# EAGLE schematic IR_CHR_LINSW_J002947Arevs (EAGLE 6.4), part 1 of 2

## Sheet 1 of 5
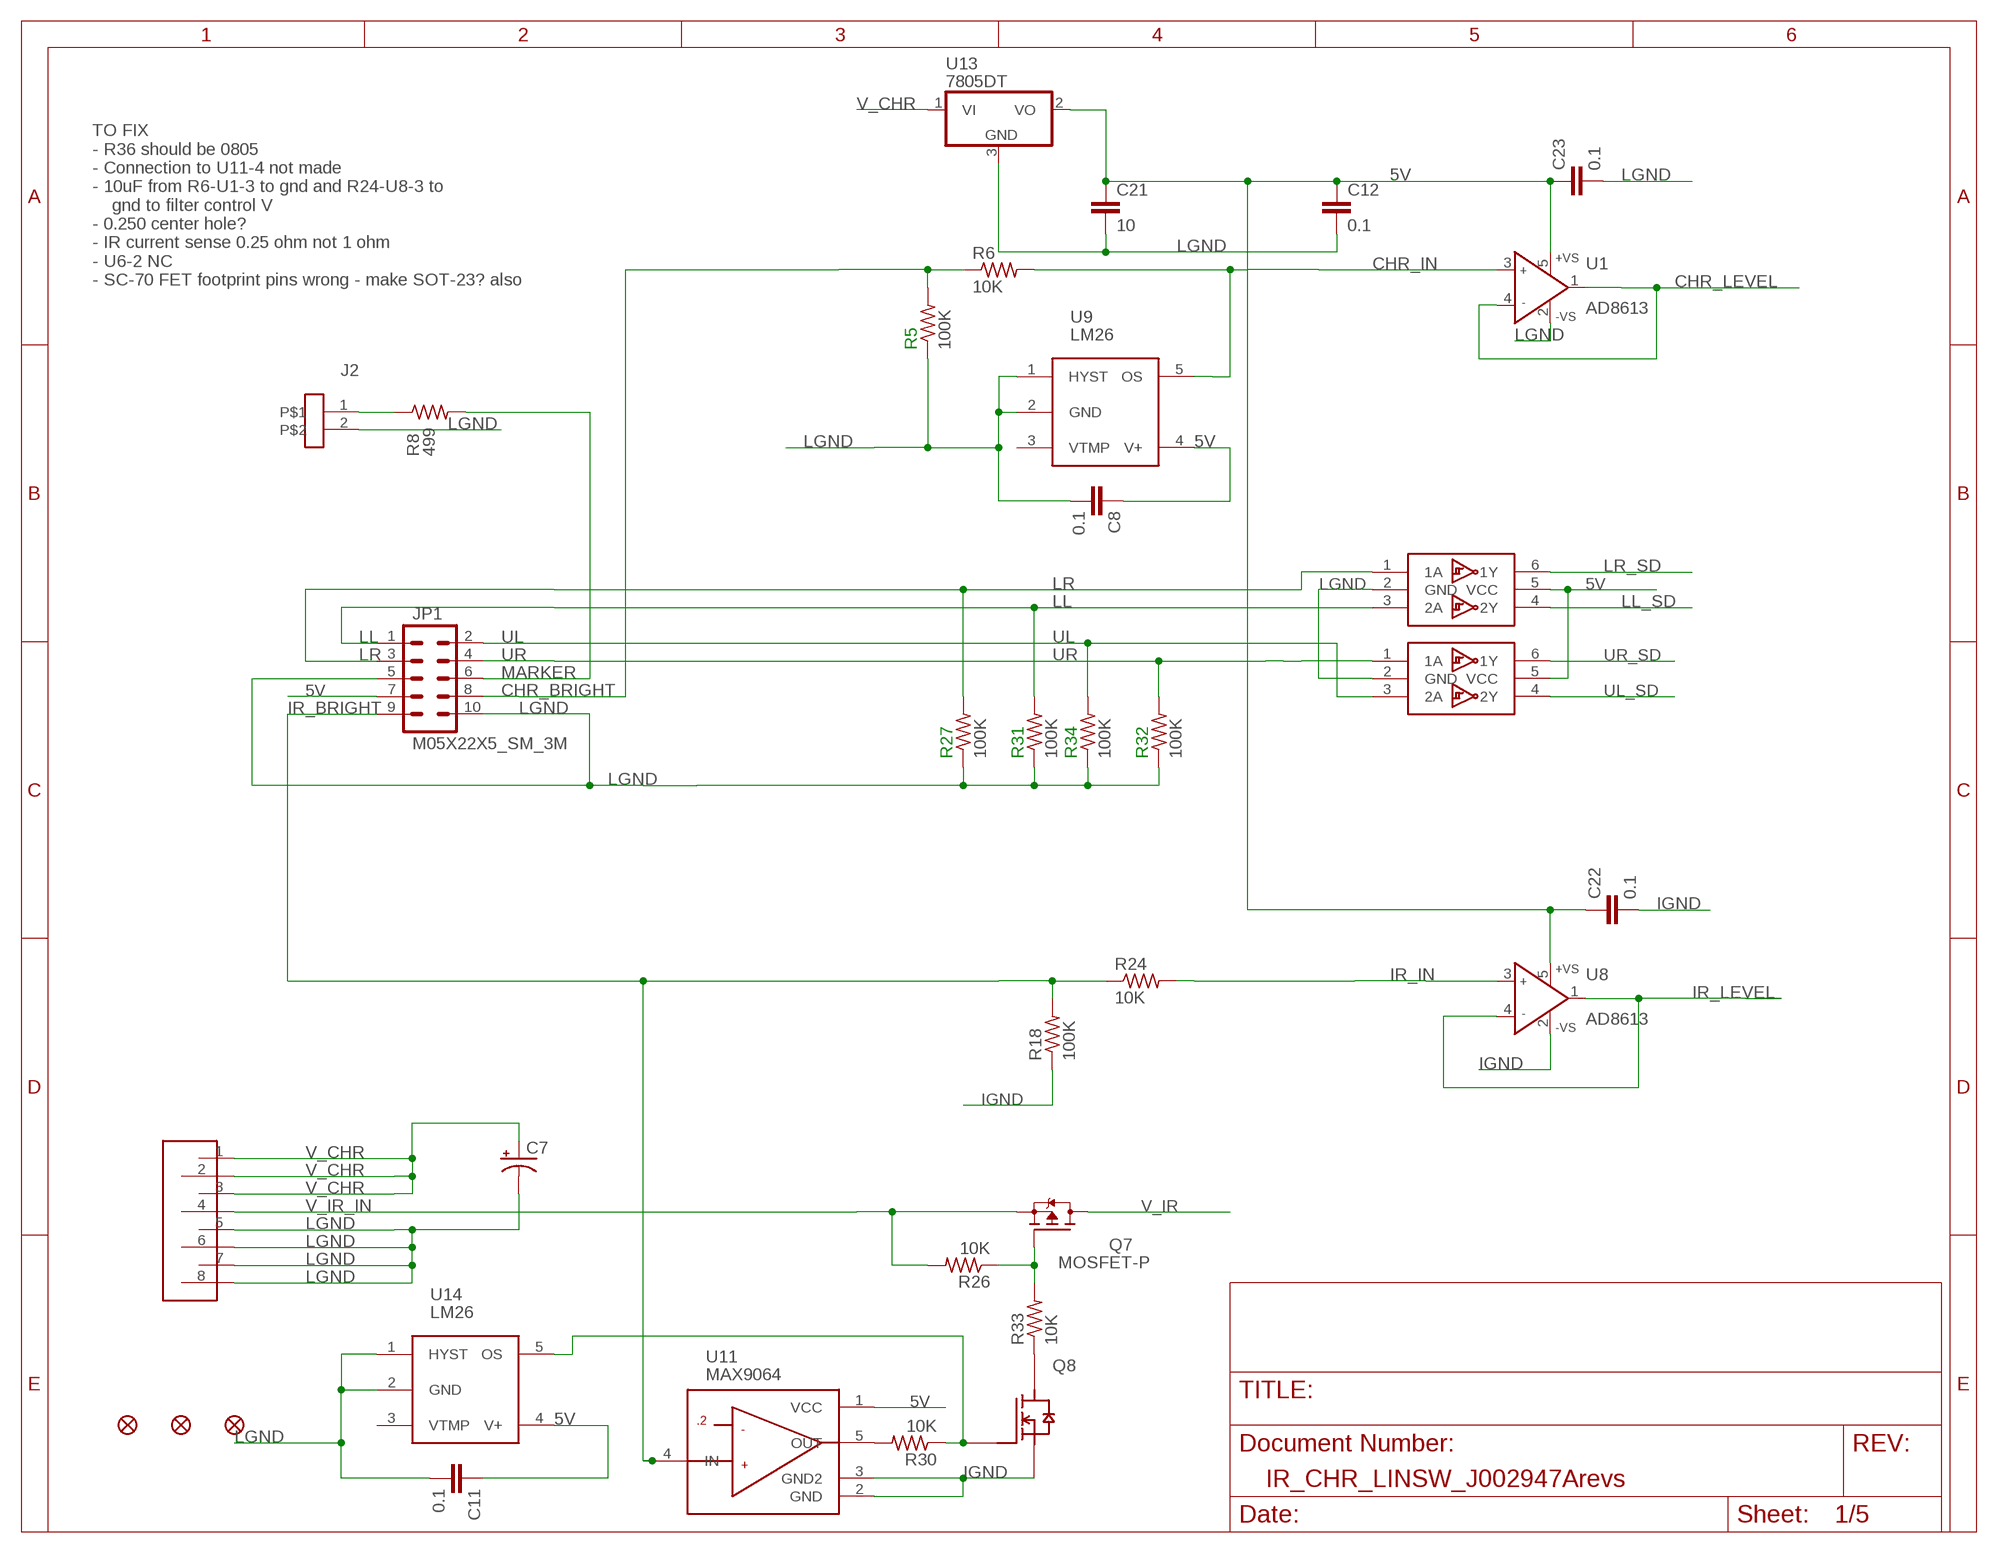
[diagram p0: schematic, sheet 1]

### Parts
C7  CAP_POLG  [PANASONIC_G]
C8  0.1  CAPS0603S  [0603S]
C11  0.1  CAPS0603S  [0603S]
C12  0.1  CAPS0603S  [0603S]
C21  10  CAPS0805S  [0805S]
C22  0.1  CAPS0603S  [0603S]
C23  0.1  CAPS0603S  [0603S]
FID1  FIDUCIAL1.5X3  [FIDUCIAL-1.5X3]
FID2  FIDUCIAL1.5X3  [FIDUCIAL-1.5X3]
FID3  FIDUCIAL1.5X3  [FIDUCIAL-1.5X3]
J1  CON8PHOENIX1778829  [PHOENIX1778829]
J2  CON2DF3-2\  [DF3-2_RA]
JP1  M05X22X5_SM_3M  [2X5-SHROUDED_SMD_3M]
Q7  MOSFET-P  [SO-8POWERPAK]
Q8  MOSFET-N  [SC-70]
R5  100K  RESISTOR_SM0603S  [0603S]
R6  10K  RESISTOR_SM0603S  [0603S]
R8  499  RESISTOR_SM0603S  [0603S]
R18  100K  RESISTOR_SM0603S  [0603S]
R24  10K  RESISTOR_SM0603S  [0603S]
R26  10K  RESISTOR_SM0603S  [0603S]
R27  100K  RESISTOR_SM0603S  [0603S]
R30  10K  RESISTOR_SM0603S  [0603S]
R31  100K  RESISTOR_SM0603S  [0603S]
R32  100K  RESISTOR_SM0603S  [0603S]
R33  10K  RESISTOR_SM0603S  [0603S]
R34  100K  RESISTOR_SM0603S  [0603S]
U1  AD8613  AD8065RT  [SOT23-5]
U8  AD8613  AD8065RT  [SOT23-5]
U9  LM26  [SOT23-5]
U10  74DUAL14  [SOT23-6]
U11  MAX9064  [SOT23-5L]
U12  74DUAL14  [SOT23-6]
U13  7805DT  [TO252]
U14  LM26  [SOT23-5]

### Nets
5V: C8.1 C11.1 C12.1 C21.1 C22.1 C23.1 JP1.7 U1.5(+VS) U8.5(+VS) U9.4(V+) U10.5(VCC) U11.1(VCC) U12.5(VCC) U13.2(VO) U14.4(V+)
CHR_BRIGHT: JP1.8 R5.2 R6.1
CHR_IN: R6.2 U1.3(IN+) U9.5(OS)
CHR_LEVEL: U1.1(OUT) U1.4(IN-) ; also sheet 2,3,4,5
IGND: C22.2 Q8.2(S) R18.1 U8.2(-VS) U11.2(GND) U11.3(GND2) ; also sheet 2,3,4,5
IR_BRIGHT: JP1.9 R18.2 R24.1 U11.4(IN)
IR_IN: R24.2 U8.3(IN+)
IR_LEVEL: U8.1(OUT) U8.4(IN-) ; also sheet 2,3,4,5
LGND: C7.- C8.2 C11.2 C12.2 C21.2 C23.2 J1.5 J1.6 J1.7 J1.8 J2.2 JP1.5 JP1.10 R5.1 R27.1 R31.1 R32.1 R34.1 U1.2(-VS) U9.1(HYST) U9.2(GND) U10.2(GND) U12.2(GND) U13.3(GND) U14.1(HYST) U14.2(GND) ; also sheet 2,3,4,5
LL: JP1.1 R31.2 U10.3(2A)
LL_SD: U10.4(2Y) ; also sheet 3
LR: JP1.3 R27.2 U10.1(1A)
LR_SD: U10.6(1Y) ; also sheet 5
MARKER: JP1.6 R8.2
N$76: J2.1 R8.1
N$171: Q7.4(G) R26.1 R33.2
N$172: Q8.1(G) R30.1 U14.5(OS)
N$173: Q8.3(D) R33.1
N$175: R30.2 U11.5(OUT)
UL: JP1.2 R34.2 U12.3(2A)
UL_SD: U12.4(2Y) ; also sheet 2
UR: JP1.4 R32.2 U12.1(1A)
UR_SD: U12.6(1Y) ; also sheet 4
V_CHR: C7.+ J1.1 J1.2 J1.3 U13.1(VI) ; also sheet 2,3,4,5
V_IR: Q7.5(D) Q7.6(D) Q7.7(D) Q7.8(D) Q7.9(D) ; also sheet 2,3,4,5
V_IR_IN: J1.4 Q7.1(S) Q7.2(S) Q7.3(S) R26.2
Unconnected: U9.3(VTMP) U14.3(VTMP)

### Notes on the sheet
- TO FIX
  - R36 should be 0805
  - Connection to U11-4 not made
  - 10uF from R6-U1-3 to gnd and R24-U8-3 to
      gnd to filter control V
  - 0.250 center hole?
  - IR current sense 0.25 ohm not 1 ohm
  - U6-2 NC
  - SC-70 FET footprint pins wrong - make SOT-23? also

## Sheet 2 of 5
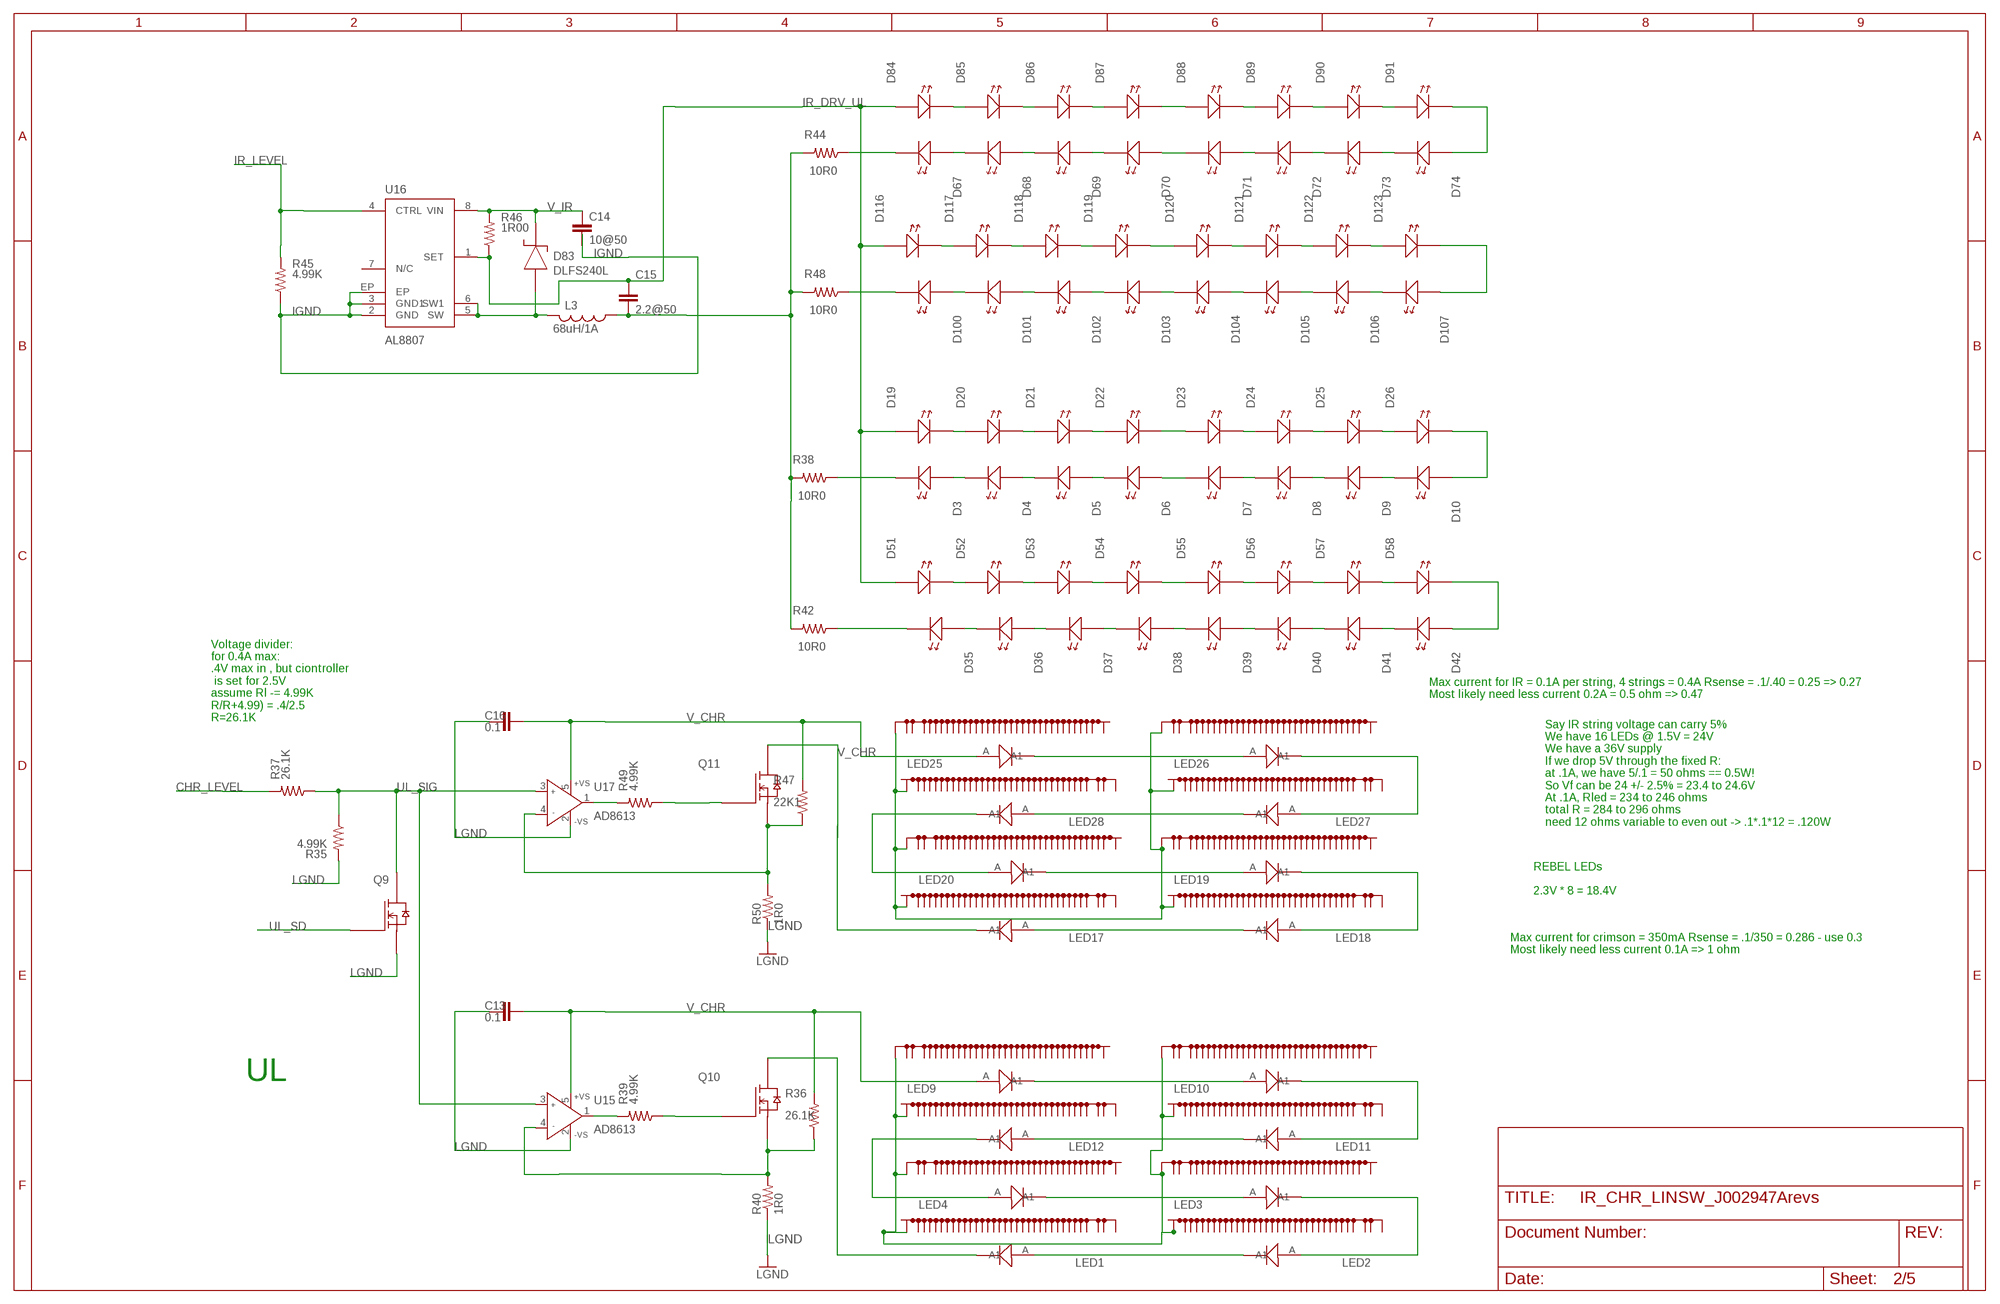
[diagram p1: schematic, sheet 2]

### Parts
C13  0.1  CAPS0603S  [0603S]
C14  10@50  CAPS1206S  [1206S]
C15  2.2@50  CAPS1206S  [1206S]
C16  0.1  CAPS0603S  [0603S]
D3  LEDLED_SFH4050_HEAT  [LED_SFH4050_HEAT]
D4  LEDLED_SFH4050_HEAT  [LED_SFH4050_HEAT]
D5  LEDLED_SFH4050_HEAT  [LED_SFH4050_HEAT]
D6  LEDLED_SFH4050_HEAT  [LED_SFH4050_HEAT]
D7  LEDLED_SFH4050_HEAT  [LED_SFH4050_HEAT]
D8  LEDLED_SFH4050_HEAT  [LED_SFH4050_HEAT]
D9  LEDLED_SFH4050_HEAT  [LED_SFH4050_HEAT]
D10  LEDLED_SFH4050_HEAT  [LED_SFH4050_HEAT]
D19  LEDLED_SFH4050_HEAT  [LED_SFH4050_HEAT]
D20  LEDLED_SFH4050_HEAT  [LED_SFH4050_HEAT]
D21  LEDLED_SFH4050_HEAT  [LED_SFH4050_HEAT]
D22  LEDLED_SFH4050_HEAT  [LED_SFH4050_HEAT]
D23  LEDLED_SFH4050_HEAT  [LED_SFH4050_HEAT]
D24  LEDLED_SFH4050_HEAT  [LED_SFH4050_HEAT]
D25  LEDLED_SFH4050_HEAT  [LED_SFH4050_HEAT]
D26  LEDLED_SFH4050_HEAT  [LED_SFH4050_HEAT]
D35  LEDLED_SFH4050_HEAT  [LED_SFH4050_HEAT]
D36  LEDLED_SFH4050_HEAT  [LED_SFH4050_HEAT]
D37  LEDLED_SFH4050_HEAT  [LED_SFH4050_HEAT]
D38  LEDLED_SFH4050_HEAT  [LED_SFH4050_HEAT]
D39  LEDLED_SFH4050_HEAT  [LED_SFH4050_HEAT]
D40  LEDLED_SFH4050_HEAT  [LED_SFH4050_HEAT]
D41  LEDLED_SFH4050_HEAT  [LED_SFH4050_HEAT]
D42  LEDLED_SFH4050_HEAT  [LED_SFH4050_HEAT]
D51  LEDLED_SFH4050_HEAT  [LED_SFH4050_HEAT]
D52  LEDLED_SFH4050_HEAT  [LED_SFH4050_HEAT]
D53  LEDLED_SFH4050_HEAT  [LED_SFH4050_HEAT]
D54  LEDLED_SFH4050_HEAT  [LED_SFH4050_HEAT]
D55  LEDLED_SFH4050_HEAT  [LED_SFH4050_HEAT]
D56  LEDLED_SFH4050_HEAT  [LED_SFH4050_HEAT]
D57  LEDLED_SFH4050_HEAT  [LED_SFH4050_HEAT]
D58  LEDLED_SFH4050_HEAT  [LED_SFH4050_HEAT]
D67  LEDLED_SFH4050_HEAT  [LED_SFH4050_HEAT]
D68  LEDLED_SFH4050_HEAT  [LED_SFH4050_HEAT]
D69  LEDLED_SFH4050_HEAT  [LED_SFH4050_HEAT]
D70  LEDLED_SFH4050_HEAT  [LED_SFH4050_HEAT]
D71  LEDLED_SFH4050_HEAT  [LED_SFH4050_HEAT]
D72  LEDLED_SFH4050_HEAT  [LED_SFH4050_HEAT]
D73  LEDLED_SFH4050_HEAT  [LED_SFH4050_HEAT]
D74  LEDLED_SFH4050_HEAT  [LED_SFH4050_HEAT]
D83  DLFS240L  DIODE_SCHOTTKYPWRDI-123  [PWRDI-123]
D84  LEDLED_SFH4050_HEAT  [LED_SFH4050_HEAT]
D85  LEDLED_SFH4050_HEAT  [LED_SFH4050_HEAT]
D86  LEDLED_SFH4050_HEAT  [LED_SFH4050_HEAT]
D87  LEDLED_SFH4050_HEAT  [LED_SFH4050_HEAT]
D88  LEDLED_SFH4050_HEAT  [LED_SFH4050_HEAT]
D89  LEDLED_SFH4050_HEAT  [LED_SFH4050_HEAT]
D90  LEDLED_SFH4050_HEAT  [LED_SFH4050_HEAT]
D91  LEDLED_SFH4050_HEAT  [LED_SFH4050_HEAT]
D100  LEDLED_SFH4050_HEAT  [LED_SFH4050_HEAT]
D101  LEDLED_SFH4050_HEAT  [LED_SFH4050_HEAT]
D102  LEDLED_SFH4050_HEAT  [LED_SFH4050_HEAT]
D103  LEDLED_SFH4050_HEAT  [LED_SFH4050_HEAT]
D104  LEDLED_SFH4050_HEAT  [LED_SFH4050_HEAT]
D105  LEDLED_SFH4050_HEAT  [LED_SFH4050_HEAT]
D106  LEDLED_SFH4050_HEAT  [LED_SFH4050_HEAT]
D107  LEDLED_SFH4050_HEAT  [LED_SFH4050_HEAT]
D116  LEDLED_SFH4050_HEAT  [LED_SFH4050_HEAT]
D117  LEDLED_SFH4050_HEAT  [LED_SFH4050_HEAT]
D118  LEDLED_SFH4050_HEAT  [LED_SFH4050_HEAT]
D119  LEDLED_SFH4050_HEAT  [LED_SFH4050_HEAT]
D120  LEDLED_SFH4050_HEAT  [LED_SFH4050_HEAT]
D121  LEDLED_SFH4050_HEAT  [LED_SFH4050_HEAT]
D122  LEDLED_SFH4050_HEAT  [LED_SFH4050_HEAT]
D123  LEDLED_SFH4050_A  [LED_SFH4045_HEAT_A]
L3  68uH/1A  INDUCTOR_SMSRU8043  [SRU8043]
LED1  REBEL_0603OG_LED_W0603_EVEN_12  [OG_LED_W0603_EVEN_12]
LED2  REBEL_0603OG_LED_W0603_EVEN_12  [OG_LED_W0603_EVEN_12]
LED3  REBEL_0603OG_LED_W0603_EVEN_12  [OG_LED_W0603_EVEN_12]
LED4  REBEL_0603OG_LED_W0603_EVEN_12  [OG_LED_W0603_EVEN_12]
LED9  REBEL_0603OG_LED_W0603_EVEN_12  [OG_LED_W0603_EVEN_12]
LED10  REBEL_0603OG_LED_W0603_EVEN_12  [OG_LED_W0603_EVEN_12]
LED11  REBEL_0603OG_LED_W0603_EVEN_12  [OG_LED_W0603_EVEN_12]
LED12  REBEL_0603OG_LED_W0603_EVEN_12  [OG_LED_W0603_EVEN_12]
LED17  REBEL_0603OG_LED_W0603_EVEN_12  [OG_LED_W0603_EVEN_12]
LED18  REBEL_0603OG_LED_W0603_EVEN_12  [OG_LED_W0603_EVEN_12]
LED19  REBEL_0603OG_LED_W0603_EVEN_12  [OG_LED_W0603_EVEN_12]
LED20  REBEL_0603OG_LED_W0603_EVEN_12  [OG_LED_W0603_EVEN_12]
LED25  REBEL_0603OG_LED_W0603_EVEN_12  [OG_LED_W0603_EVEN_12]
LED26  REBEL_0603OG_LED_W0603_EVEN_12  [OG_LED_W0603_EVEN_12]
LED27  REBEL_0603OG_LED_W0603_EVEN_12  [OG_LED_W0603_EVEN_12]
LED28  REBEL_0603OG_LED_W0603_EVEN_12  [OG_LED_W0603_EVEN_12]
Q9  MOSFET-N  [SC-70]
Q10  MOSFET-NTI252_HS  [TO252_HS]
Q11  MOSFET-NTI252_HS  [TO252_HS]
R35  4.99K  RESISTOR_SM0603S  [0603S]
R36  26.1K  RESISTOR_SM0603S  [0603S]
R37  26.1K  RESISTOR_SM0603S  [0603S]
R38  10R0  RESISTOR_SM1206S  [1206S]
R39  4.99K  RESISTOR_SM0603S  [0603S]
R40  1R0  RESISTOR-POWER2512_HS1  [2512WIDE_HS1]
R42  10R0  RESISTOR_SM1206S  [1206S]
R44  10R0  RESISTOR_SM1206S  [1206S]
R45  4.99K  RESISTOR_SM0805S  [0805S]
R46  1R00  RESISTOR_SM1206S  [1206S]
R47  22K1  RESISTOR_SM0805S  [0805S]
R48  10R0  RESISTOR_SM1206S  [1206S]
R49  4.99K  RESISTOR_SM0603S  [0603S]
R50  1R0  RESISTOR-POWER2512_HS1  [2512WIDE_HS1]
U15  AD8613  AD8065RT  [SOT23-5]
U16  AL8807  AD8807  [MSOP8-EP]
U17  AD8613  AD8065RT  [SOT23-5]

### Nets
CHR_LEVEL: R37.2 ; also sheet 1,3,4,5
IGND: C14.2 R45.1 U16.2(GND) U16.3(GND1) U16.EP ; also sheet 1,3,4,5
IR_DRV_UL: C15.1 D19.A D19.A1(A) D51.A D51.A1(A) D84.A D84.A1(A) D116.A D116.A1(A) R46.1 U16.1(SET)
IR_LEVEL: R45.2 U16.4(CTRL) ; also sheet 1,3,4,5
IR_RET_UL: C15.2 L3.1 R38.2 R42.2 R44.2 R48.2
LGND: C13.2 C16.2 Q9.2(S) R35.2 R40.1 R40.1A R40.1A1 R40.1B R40.1B1 R40.1C R50.1 R50.1A R50.1A1 R50.1B R50.1B1 R50.1C U15.2(-VS) U17.2(-VS) ; also sheet 1,3,4,5
N$1: D9.A D9.A1(A) D10.C1(K) D10.C(K)
N$2: D8.A D8.A1(A) D9.C1(K) D9.C(K)
N$3: D73.A D73.A1(A) D74.C1(K) D74.C(K)
N$4: D72.A D72.A1(A) D73.C1(K) D73.C(K)
N$5: D71.A D71.A1(A) D72.C1(K) D72.C(K)
N$6: D69.A D69.A1(A) D70.C1(K) D70.C(K)
N$7: D68.A D68.A1(A) D69.C1(K) D69.C(K)
N$8: D67.A D67.A1(A) D68.C1(K) D68.C(K)
N$9: D7.A D7.A1(A) D8.C1(K) D8.C(K)
N$10: D5.A D5.A1(A) D6.C1(K) D6.C(K)
N$11: D4.A D4.A1(A) D5.C1(K) D5.C(K)
N$12: D3.A D3.A1(A) D4.C1(K) D4.C(K)
N$13: D19.C1(K) D19.C(K) D20.A D20.A1(A)
N$14: D84.C1(K) D84.C(K) D85.A D85.A1(A)
N$15: D20.C1(K) D20.C(K) D21.A D21.A1(A)
N$16: D85.C1(K) D85.C(K) D86.A D86.A1(A)
N$17: D86.C1(K) D86.C(K) D87.A D87.A1(A)
N$18: D70.A D70.A1(A) D71.C1(K) D71.C(K)
N$19: D106.A D106.A1(A) D107.C1(K) D107.C(K)
N$20: D105.A D105.A1(A) D106.C1(K) D106.C(K)
N$21: D104.A D104.A1(A) D105.C1(K) D105.C(K)
N$22: D103.A D103.A1(A) D104.C1(K) D104.C(K)
N$23: D102.A D102.A1(A) D103.C1(K) D103.C(K)
N$24: D21.C1(K) D21.C(K) D22.A D22.A1(A)
N$25: D6.A D6.A1(A) D7.C1(K) D7.C(K)
N$26: D41.A D41.A1(A) D42.C1(K) D42.C(K)
N$27: D40.A D40.A1(A) D41.C1(K) D41.C(K)
N$28: D39.A D39.A1(A) D40.C1(K) D40.C(K)
N$29: D101.A D101.A1(A) D102.C1(K) D102.C(K)
N$30: D38.A D38.A1(A) D39.C1(K) D39.C(K)
N$31: D37.A D37.A1(A) D38.C1(K) D38.C(K)
N$32: D100.A D100.A1(A) D101.C1(K) D101.C(K)
N$33: D88.C1(K) D88.C(K) D89.A D89.A1(A)
N$34: D89.C1(K) D89.C(K) D90.A D90.A1(A)
N$35: D36.A D36.A1(A) D37.C1(K) D37.C(K)
N$36: D90.C1(K) D90.C(K) D91.A D91.A1(A)
N$37: D35.A D35.A1(A) D36.C1(K) D36.C(K)
N$38: D23.C1(K) D23.C(K) D24.A D24.A1(A)
N$39: D24.C1(K) D24.C(K) D25.A D25.A1(A)
N$40: D25.C1(K) D25.C(K) D26.A D26.A1(A)
N$41: D51.C1(K) D51.C(K) D52.A D52.A1(A)
N$42: D52.C1(K) D52.C(K) D53.A D53.A1(A)
N$43: D53.C1(K) D53.C(K) D54.A D54.A1(A)
N$44: D55.C1(K) D55.C(K) D56.A D56.A1(A)
N$45: D56.C1(K) D56.C(K) D57.A D57.A1(A)
N$46: D57.C1(K) D57.C(K) D58.A D58.A1(A)
N$47: D116.C1(K) D116.C(K) D117.A D117.A1(A)
N$48: D22.C1(K) D22.C(K) D23.A D23.A1(A)
N$49: D117.C1(K) D117.C(K) D118.A D118.A1(A)
N$50: D10.A D10.A1(A) D26.C1(K) D26.C(K)
N$51: D54.C1(K) D54.C(K) D55.A D55.A1(A)
N$52: D118.C1(K) D118.C(K) D119.A D119.A1(A)
N$53: D3.C1(K) D3.C(K) R38.1
N$54: D42.A D42.A1(A) D58.C1(K) D58.C(K)
N$55: D35.C1(K) D35.C(K) R42.1
N$58: D67.C1(K) D67.C(K) R44.1
N$61: D120.C1(K) D120.C(K) D121.A D121.A1(A)
N$62: R49.2 U17.1(OUT)
N$64: D121.C1(K) D121.C(K) D122.A D122.A1(A)
N$65: D122.C1(K) D122.C(K) D123.A D123.A1(A)
N$66: Q10.2(S) R36.1 R40.2 U15.4(IN-)
N$67: D83.A L3.2 U16.5(SW) U16.6(SW1)
N$68: D87.C1(K) D87.C(K) D88.A D88.A1(A)
N$70: D74.A D74.A1(A) D91.C1(K) D91.C(K)
N$71: LED9.C(K1) LED10.A(A1)
N$72: D119.C1(K) D119.C(K) D120.A D120.A1(A)
N$74: LED10.C(K1) LED11.A(A1)
N$75: D107.A D107.A1(A) D123.C(K)
N$77: LED11.C(K1) LED12.A(A1)
N$78: D100.C1(K) D100.C(K) R48.1
N$79: LED4.A(A1) LED12.C(K1)
N$80: LED3.A(A1) LED4.C(K1)
N$81: LED2.A(A1) LED3.C(K1)
N$82: Q10.1(G) R39.1
N$83: LED1.A(A1) LED2.C(K1)
N$84: R39.2 U15.1(OUT)
N$128: LED25.C(K1) LED26.A(A1)
N$129: LED26.C(K1) LED27.A(A1)
N$130: LED27.C(K1) LED28.A(A1)
N$131: LED20.A(A1) LED28.C(K1)
N$133: LED19.A(A1) LED20.C(K1)
N$134: LED18.A(A1) LED19.C(K1)
N$135: LED17.A(A1) LED18.C(K1)
N$208: Q11.2(S) R47.1 R50.2 U17.4(IN-)
N$217: Q11.1(G) R49.1
Q11: LED1.C(K1) Q10.3(D) Q10.3S(D) Q10.P$1(D) Q10.P$2(D) Q10.P$3(D) Q10.P$4(D) Q10.P$5(D) Q10.P$6(D) Q10.P$7(D) Q10.P$8(D) Q10.P$9(D) Q10.P$10(D) Q10.P$11(D) Q10.P$12(D)
Q12: LED17.C(K1) Q11.3(D) Q11.3S(D) Q11.P$1(D) Q11.P$2(D) Q11.P$3(D) Q11.P$4(D) Q11.P$5(D) Q11.P$6(D) Q11.P$7(D) Q11.P$8(D) Q11.P$9(D) Q11.P$10(D) Q11.P$11(D) Q11.P$12(D)
TH: LED1.TH1(TH) LED2.TH1(TH) LED3.TH@68(TH) LED4.TH@68(TH) LED9.TH@68(TH) LED10.TH@68(TH) LED11.TH1(TH) LED12.TH1(TH) LED17.TH1(TH) LED18.TH1(TH) LED19.TH@68(TH) LED20.TH@68(TH) LED25.TH@68(TH) LED26.TH@68(TH) LED27.TH1(TH) LED28.TH1(TH) ; also sheet 3,4,5
UL_SD: Q9.1(G) ; also sheet 1
UL_SIG: Q9.3(D) R35.1 R37.1 U15.3(IN+) U17.3(IN+)
V_CHR: C13.1 C16.1 LED9.A(A1) LED25.A(A1) R36.2 R47.2 U15.5(+VS) U17.5(+VS) ; also sheet 1,3,4,5
V_IR: C14.1 D83.K R46.2 U16.8(VIN) ; also sheet 1,3,4,5
Unconnected: U16.7(N/C)

### Notes on the sheet
- Max current for IR = 0.1A per string, 4 strings = 0.4A Rsense = .1/.40 = 0.25 => 0.27
  Most likely need less current 0.2A = 0.5 ohm => 0.47
- Voltage divider:
  for 0.4A max:
  .4V max in , but ciontroller
   is set for 2.5V
  assume Rl -= 4.99K
  R/R+4.99) = .4/2.5
  R=26.1K
- Say IR string voltage can carry 5%
  We have 16 LEDs @ 1.5V = 24V
  We have a 36V supply
  If we drop 5V through the fixed R:
  at .1A, we have 5/.1 = 50 ohms == 0.5W!
  So Vf can be 24 +/- 2.5% = 23.4 to 24.6V
  At .1A, Rled = 234 to 246 ohms
  total R = 284 to 296 ohms
  need 12 ohms variable to even out -> .1*.1*12 = .120W
- REBEL LEDs
  
  2.3V * 8 = 18.4V
- Max current for crimson = 350mA Rsense = .1/350 = 0.286 - use 0.3
  Most likely need less current 0.1A => 1 ohm
- UL

## Sheet 3 of 5
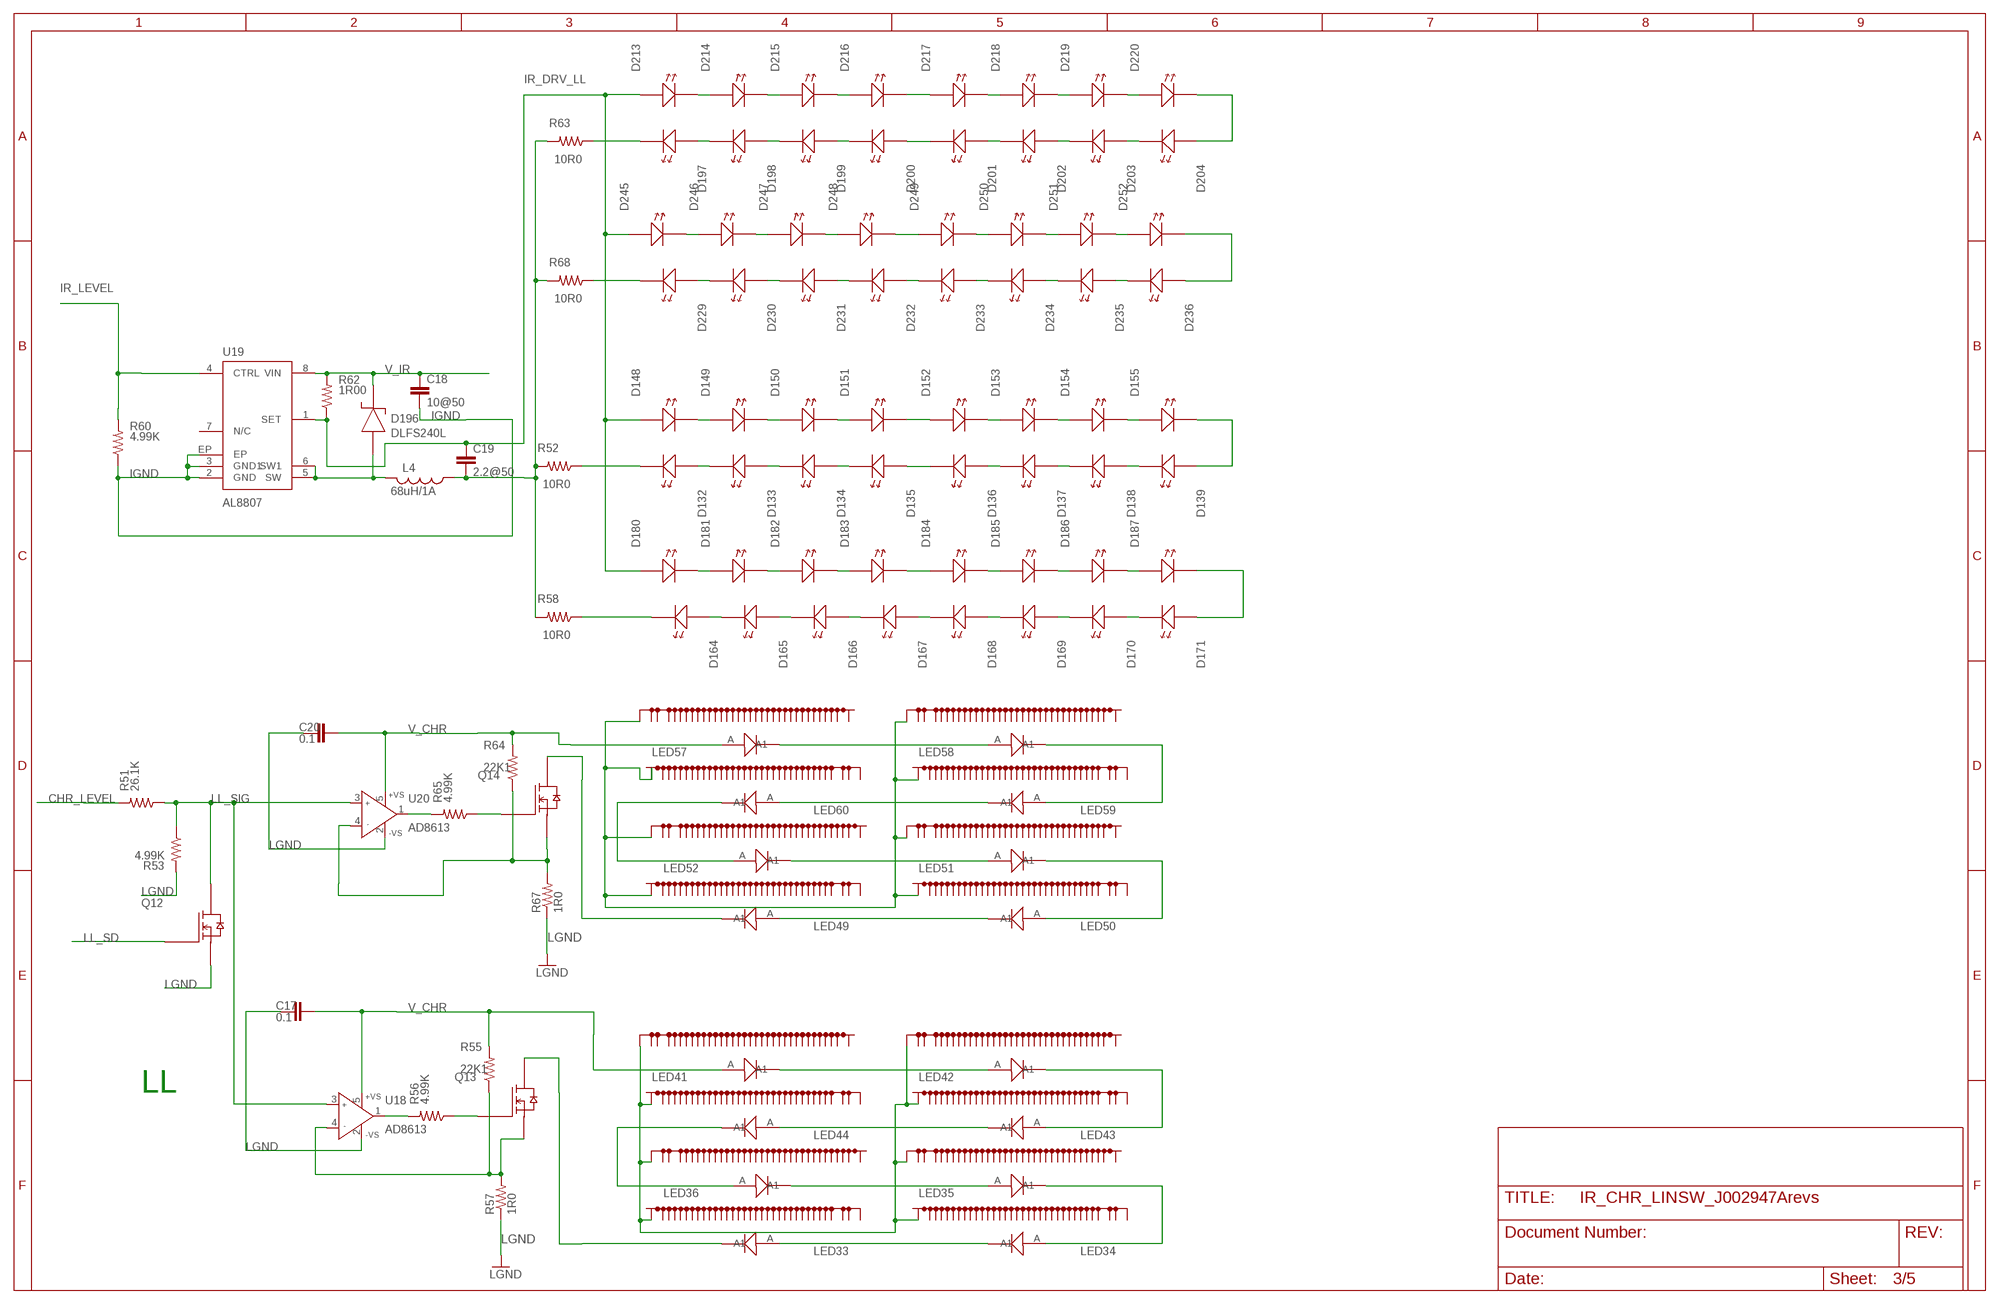
[diagram p2: schematic, sheet 3]

### Parts
C17  0.1  CAPS0603S  [0603S]
C18  10@50  CAPS1206S  [1206S]
C19  2.2@50  CAPS1206S  [1206S]
C20  0.1  CAPS0603S  [0603S]
D132  LEDLED_SFH4050_HEAT  [LED_SFH4050_HEAT]
D133  LEDLED_SFH4050_HEAT  [LED_SFH4050_HEAT]
D134  LEDLED_SFH4050_HEAT  [LED_SFH4050_HEAT]
D135  LEDLED_SFH4050_HEAT  [LED_SFH4050_HEAT]
D136  LEDLED_SFH4050_HEAT  [LED_SFH4050_HEAT]
D137  LEDLED_SFH4050_HEAT  [LED_SFH4050_HEAT]
D138  LEDLED_SFH4050_HEAT  [LED_SFH4050_HEAT]
D139  LEDLED_SFH4050_C  [LED_SFH4050_HEAT_C]
D148  LEDLED_SFH4050_HEAT  [LED_SFH4050_HEAT]
D149  LEDLED_SFH4050_HEAT  [LED_SFH4050_HEAT]
D150  LEDLED_SFH4050_HEAT  [LED_SFH4050_HEAT]
D151  LEDLED_SFH4050_HEAT  [LED_SFH4050_HEAT]
D152  LEDLED_SFH4050_HEAT  [LED_SFH4050_HEAT]
D153  LEDLED_SFH4050_HEAT  [LED_SFH4050_HEAT]
D154  LEDLED_SFH4050_HEAT  [LED_SFH4050_HEAT]
D155  LEDLED_SFH4050_HEAT  [LED_SFH4050_HEAT]
D164  LEDLED_SFH4050_HEAT  [LED_SFH4050_HEAT]
D165  LEDLED_SFH4050_HEAT  [LED_SFH4050_HEAT]
D166  LEDLED_SFH4050_HEAT  [LED_SFH4050_HEAT]
D167  LEDLED_SFH4050_HEAT  [LED_SFH4050_HEAT]
D168  LEDLED_SFH4050_HEAT  [LED_SFH4050_HEAT]
D169  LEDLED_SFH4050_HEAT  [LED_SFH4050_HEAT]
D170  LEDLED_SFH4050_HEAT  [LED_SFH4050_HEAT]
D171  LEDLED_SFH4050_HEAT  [LED_SFH4050_HEAT]
D180  LEDLED_SFH4050_HEAT  [LED_SFH4050_HEAT]
D181  LEDLED_SFH4050_HEAT  [LED_SFH4050_HEAT]
D182  LEDLED_SFH4050_HEAT  [LED_SFH4050_HEAT]
D183  LEDLED_SFH4050_HEAT  [LED_SFH4050_HEAT]
D184  LEDLED_SFH4050_HEAT  [LED_SFH4050_HEAT]
D185  LEDLED_SFH4050_HEAT  [LED_SFH4050_HEAT]
D186  LEDLED_SFH4050_HEAT  [LED_SFH4050_HEAT]
D187  LEDLED_SFH4050_HEAT  [LED_SFH4050_HEAT]
D196  DLFS240L  DIODE_SCHOTTKYPWRDI-123  [PWRDI-123]
D197  LEDLED_SFH4050_HEAT  [LED_SFH4050_HEAT]
D198  LEDLED_SFH4050_HEAT  [LED_SFH4050_HEAT]
D199  LEDLED_SFH4050_HEAT  [LED_SFH4050_HEAT]
D200  LEDLED_SFH4050_HEAT  [LED_SFH4050_HEAT]
D201  LEDLED_SFH4050_HEAT  [LED_SFH4050_HEAT]
D202  LEDLED_SFH4050_HEAT  [LED_SFH4050_HEAT]
D203  LEDLED_SFH4050_HEAT  [LED_SFH4050_HEAT]
D204  LEDLED_SFH4050_HEAT  [LED_SFH4050_HEAT]
D213  LEDLED_SFH4050_HEAT  [LED_SFH4050_HEAT]
D214  LEDLED_SFH4050_HEAT  [LED_SFH4050_HEAT]
D215  LEDLED_SFH4050_HEAT  [LED_SFH4050_HEAT]
D216  LEDLED_SFH4050_HEAT  [LED_SFH4050_HEAT]
D217  LEDLED_SFH4050_HEAT  [LED_SFH4050_HEAT]
D218  LEDLED_SFH4050_HEAT  [LED_SFH4050_HEAT]
D219  LEDLED_SFH4050_HEAT  [LED_SFH4050_HEAT]
D220  LEDLED_SFH4050_HEAT  [LED_SFH4050_HEAT]
D229  LEDLED_SFH4050_HEAT  [LED_SFH4050_HEAT]
D230  LEDLED_SFH4050_HEAT  [LED_SFH4050_HEAT]
D231  LEDLED_SFH4050_HEAT  [LED_SFH4050_HEAT]
D232  LEDLED_SFH4050_HEAT  [LED_SFH4050_HEAT]
D233  LEDLED_SFH4050_HEAT  [LED_SFH4050_HEAT]
D234  LEDLED_SFH4050_HEAT  [LED_SFH4050_HEAT]
D235  LEDLED_SFH4050_HEAT  [LED_SFH4050_HEAT]
D236  LEDLED_SFH4050_HEAT  [LED_SFH4050_HEAT]
D245  LEDLED_SFH4050_HEAT  [LED_SFH4050_HEAT]
D246  LEDLED_SFH4050_HEAT  [LED_SFH4050_HEAT]
D247  LEDLED_SFH4050_HEAT  [LED_SFH4050_HEAT]
D248  LEDLED_SFH4050_HEAT  [LED_SFH4050_HEAT]
D249  LEDLED_SFH4050_HEAT  [LED_SFH4050_HEAT]
D250  LEDLED_SFH4050_HEAT  [LED_SFH4050_HEAT]
D251  LEDLED_SFH4050_HEAT  [LED_SFH4050_HEAT]
D252  LEDLED_SFH4050_HEAT  [LED_SFH4050_HEAT]
L4  68uH/1A  INDUCTOR_SMSRU8043  [SRU8043]
LED33  REBEL_0603OG_LED_W0603_EVEN_12  [OG_LED_W0603_EVEN_12]
LED34  REBEL_0603OG_LED_W0603_EVEN_12  [OG_LED_W0603_EVEN_12]
LED35  REBEL_0603OG_LED_W0603_EVEN_12  [OG_LED_W0603_EVEN_12]
LED36  REBEL_0603OG_LED_W0603_EVEN_12  [OG_LED_W0603_EVEN_12]
LED41  REBEL_0603OG_LED_W0603_EVEN_12  [OG_LED_W0603_EVEN_12]
LED42  REBEL_0603OG_LED_W0603_EVEN_12  [OG_LED_W0603_EVEN_12]
LED43  REBEL_0603OG_LED_W0603_EVEN_12  [OG_LED_W0603_EVEN_12]
LED44  REBEL_0603OG_LED_W0603_EVEN_12  [OG_LED_W0603_EVEN_12]
LED49  REBEL_0603OG_LED_W0603_EVEN_12  [OG_LED_W0603_EVEN_12]
LED50  REBEL_0603OG_LED_W0603_EVEN_12  [OG_LED_W0603_EVEN_12]
LED51  REBEL_0603OG_LED_W0603_EVEN_12  [OG_LED_W0603_EVEN_12]
LED52  REBEL_0603OG_LED_W0603_EVEN_12  [OG_LED_W0603_EVEN_12]
LED57  REBEL_0603OG_LED_W0603_EVEN_12  [OG_LED_W0603_EVEN_12]
LED58  REBEL_0603OG_LED_W0603_EVEN_12  [OG_LED_W0603_EVEN_12]
LED59  REBEL_0603OG_LED_W0603_EVEN_12  [OG_LED_W0603_EVEN_12]
LED60  REBEL_0603OG_LED_W0603_EVEN_12  [OG_LED_W0603_EVEN_12]
Q12  MOSFET-N  [SC-70]
Q13  MOSFET-NTI252_HS  [TO252_HS]
Q14  MOSFET-NTI252_HS  [TO252_HS]
R51  26.1K  RESISTOR_SM0603S  [0603S]
R52  10R0  RESISTOR_SM1206S  [1206S]
R53  4.99K  RESISTOR_SM0603S  [0603S]
R55  22K1  RESISTOR_SM0805S  [0805S]
R56  4.99K  RESISTOR_SM0603S  [0603S]
R57  1R0  RESISTOR-POWER2512_HS1  [2512WIDE_HS1]
R58  10R0  RESISTOR_SM1206S  [1206S]
R60  4.99K  RESISTOR_SM0805S  [0805S]
R62  1R00  RESISTOR_SM1206S  [1206S]
R63  10R0  RESISTOR_SM1206S  [1206S]
R64  22K1  RESISTOR_SM0805S  [0805S]
R65  4.99K  RESISTOR_SM0603S  [0603S]
R67  1R0  RESISTOR-POWER2512_HS1  [2512WIDE_HS1]
R68  10R0  RESISTOR_SM1206S  [1206S]
U18  AD8613  AD8065RT  [SOT23-5]
U19  AL8807  AD8807  [MSOP8-EP]
U20  AD8613  AD8065RT  [SOT23-5]

### Nets
CHR_LEVEL: R51.2 ; also sheet 1,2,4,5
IGND: C18.2 R60.1 U19.2(GND) U19.3(GND1) U19.EP ; also sheet 1,2,4,5
IR_DRV_LL: C19.1 D148.A D148.A1(A) D180.A D180.A1(A) D213.A D213.A1(A) D245.A D245.A1(A) R62.1 U19.1(SET)
IR_LEVEL: R60.2 U19.4(CTRL) ; also sheet 1,2,4,5
IR_RET_LL: C19.2 L4.1 R52.2 R58.2 R63.2 R68.2
LGND: C17.2 C20.2 Q12.2(S) R53.2 R57.1 R57.1A R57.1A1 R57.1B R57.1B1 R57.1C R67.1 R67.1A R67.1A1 R67.1B R67.1B1 R67.1C U18.2(-VS) U20.2(-VS) ; also sheet 1,2,4,5
LL_SD: Q12.1(G) ; also sheet 1
LL_SIG: Q12.3(D) R51.1 R53.1 U18.3(IN+) U20.3(IN+)
N$56: D196.A L4.2 U19.5(SW) U19.6(SW1)
N$57: D203.A D203.A1(A) D204.C1(K) D204.C(K)
N$60: Q14.1(G) R65.1
N$63: D202.A D202.A1(A) D203.C1(K) D203.C(K)
N$69: Q13.1(G) R56.1
N$86: R65.2 U20.1(OUT)
N$87: D201.A D201.A1(A) D202.C1(K) D202.C(K)
N$89: D199.A D199.A1(A) D200.C1(K) D200.C(K)
N$91: D198.A D198.A1(A) D199.C1(K) D199.C(K)
N$92: D197.A D197.A1(A) D198.C1(K) D198.C(K)
N$93: D213.C1(K) D213.C(K) D214.A D214.A1(A)
N$94: D214.C1(K) D214.C(K) D215.A D215.A1(A)
N$95: D215.C1(K) D215.C(K) D216.A D216.A1(A)
N$96: D200.A D200.A1(A) D201.C1(K) D201.C(K)
N$97: D235.A D235.A1(A) D236.C1(K) D236.C(K)
N$98: D234.A D234.A1(A) D235.C1(K) D235.C(K)
N$99: D233.A D233.A1(A) D234.C1(K) D234.C(K)
N$100: D232.A D232.A1(A) D233.C1(K) D233.C(K)
N$101: D231.A D231.A1(A) D232.C1(K) D232.C(K)
N$102: D230.A D230.A1(A) D231.C1(K) D231.C(K)
N$103: D229.A D229.A1(A) D230.C1(K) D230.C(K)
N$104: D217.C1(K) D217.C(K) D218.A D218.A1(A)
N$105: D218.C1(K) D218.C(K) D219.A D219.A1(A)
N$106: D219.C1(K) D219.C(K) D220.A D220.A1(A)
N$107: D245.C1(K) D245.C(K) D246.A D246.A1(A)
N$108: D246.C1(K) D246.C(K) D247.A D247.A1(A)
N$109: D247.C1(K) D247.C(K) D248.A D248.A1(A)
N$110: D249.C1(K) D249.C(K) D250.A D250.A1(A)
N$111: D250.C1(K) D250.C(K) D251.A D251.A1(A)
N$112: D251.C1(K) D251.C(K) D252.A D252.A1(A)
N$113: D216.C1(K) D216.C(K) D217.A D217.A1(A)
N$114: D204.A D204.A1(A) D220.C1(K) D220.C(K)
N$115: D248.C1(K) D248.C(K) D249.A D249.A1(A)
N$116: D236.A D236.A1(A) D252.C1(K) D252.C(K)
N$117: Q13.2(S) R55.1 R57.2 U18.4(IN-)
N$119: LED57.C(K1) LED58.A(A1)
N$120: LED58.C(K1) LED59.A(A1)
N$121: LED59.C(K1) LED60.A(A1)
N$122: LED52.A(A1) LED60.C(K1)
N$123: LED51.A(A1) LED52.C(K1)
N$125: LED50.A(A1) LED51.C(K1)
N$126: R56.2 U18.1(OUT)
N$127: LED49.A(A1) LED50.C(K1)
N$132: Q14.2(S) R64.1 R67.2 U20.4(IN-)
N$141: D138.A D138.A1(A) D139.C1(K) D139.C(K)
N$142: D137.A D137.A1(A) D138.C1(K) D138.C(K)
N$143: D136.A D136.A1(A) D137.C1(K) D137.C(K)
N$144: D134.A D134.A1(A) D135.C1(K) D135.C(K)
N$145: D133.A D133.A1(A) D134.C1(K) D134.C(K)
N$146: D132.A D132.A1(A) D133.C1(K) D133.C(K)
N$147: D148.C1(K) D148.C(K) D149.A D149.A1(A)
N$148: D149.C1(K) D149.C(K) D150.A D150.A1(A)
N$149: D150.C1(K) D150.C(K) D151.A D151.A1(A)
N$150: D135.A D135.A1(A) D136.C1(K) D136.C(K)
N$151: D170.A D170.A1(A) D171.C1(K) D171.C(K)
N$152: D169.A D169.A1(A) D170.C1(K) D170.C(K)
N$153: D168.A D168.A1(A) D169.C1(K) D169.C(K)
N$154: D167.A D167.A1(A) D168.C1(K) D168.C(K)
N$155: D166.A D166.A1(A) D167.C1(K) D167.C(K)
N$156: D165.A D165.A1(A) D166.C1(K) D166.C(K)
N$157: D164.A D164.A1(A) D165.C1(K) D165.C(K)
N$158: D152.C1(K) D152.C(K) D153.A D153.A1(A)
N$159: D153.C1(K) D153.C(K) D154.A D154.A1(A)
N$160: D154.C1(K) D154.C(K) D155.A D155.A1(A)
N$161: D180.C1(K) D180.C(K) D181.A D181.A1(A)
N$162: D181.C1(K) D181.C(K) D182.A D182.A1(A)
N$163: D182.C1(K) D182.C(K) D183.A D183.A1(A)
N$164: D184.C1(K) D184.C(K) D185.A D185.A1(A)
N$165: D185.C1(K) D185.C(K) D186.A D186.A1(A)
N$166: D186.C1(K) D186.C(K) D187.A D187.A1(A)
N$167: D151.C1(K) D151.C(K) D152.A D152.A1(A)
N$168: D139.A D155.C1(K) D155.C(K)
N$169: D183.C1(K) D183.C(K) D184.A D184.A1(A)
N$170: D171.A D171.A1(A) D187.C1(K) D187.C(K)
N$176: LED41.C(K1) LED42.A(A1)
N$177: LED42.C(K1) LED43.A(A1)
N$178: LED43.C(K1) LED44.A(A1)
N$179: LED36.A(A1) LED44.C(K1)
N$180: LED35.A(A1) LED36.C(K1)
N$181: LED34.A(A1) LED35.C(K1)
N$182: LED33.A(A1) LED34.C(K1)
N$187: D132.C1(K) D132.C(K) R52.1
N$188: D164.C1(K) D164.C(K) R58.1
N$191: D197.C1(K) D197.C(K) R63.1
N$194: D229.C1(K) D229.C(K) R68.1
Q14: LED33.C(K1) Q13.3(D) Q13.3S(D) Q13.P$1(D) Q13.P$2(D) Q13.P$3(D) Q13.P$4(D) Q13.P$5(D) Q13.P$6(D) Q13.P$7(D) Q13.P$8(D) Q13.P$9(D) Q13.P$10(D) Q13.P$11(D) Q13.P$12(D)
Q16: LED49.C(K1) Q14.3(D) Q14.3S(D) Q14.P$1(D) Q14.P$2(D) Q14.P$3(D) Q14.P$4(D) Q14.P$5(D) Q14.P$6(D) Q14.P$7(D) Q14.P$8(D) Q14.P$9(D) Q14.P$10(D) Q14.P$11(D) Q14.P$12(D)
TH: LED33.TH1(TH) LED34.TH1(TH) LED35.TH@68(TH) LED36.TH@68(TH) LED41.TH@68(TH) LED42.TH@68(TH) LED43.TH1(TH) LED44.TH1(TH) LED49.TH1(TH) LED50.TH1(TH) LED51.TH@68(TH) LED52.TH@68(TH) LED57.TH@68(TH) LED58.TH@68(TH) LED59.TH1(TH) ; also sheet 2,4,5
V_CHR: C17.1 C20.1 LED41.A(A1) LED57.A(A1) R55.2 R64.2 U18.5(+VS) U20.5(+VS) ; also sheet 1,2,4,5
V_IR: C18.1 D196.K R62.2 U19.8(VIN) ; also sheet 1,2,4,5
Unconnected: U19.7(N/C)

### Notes on the sheet
- LL

## Sheet 4 of 5
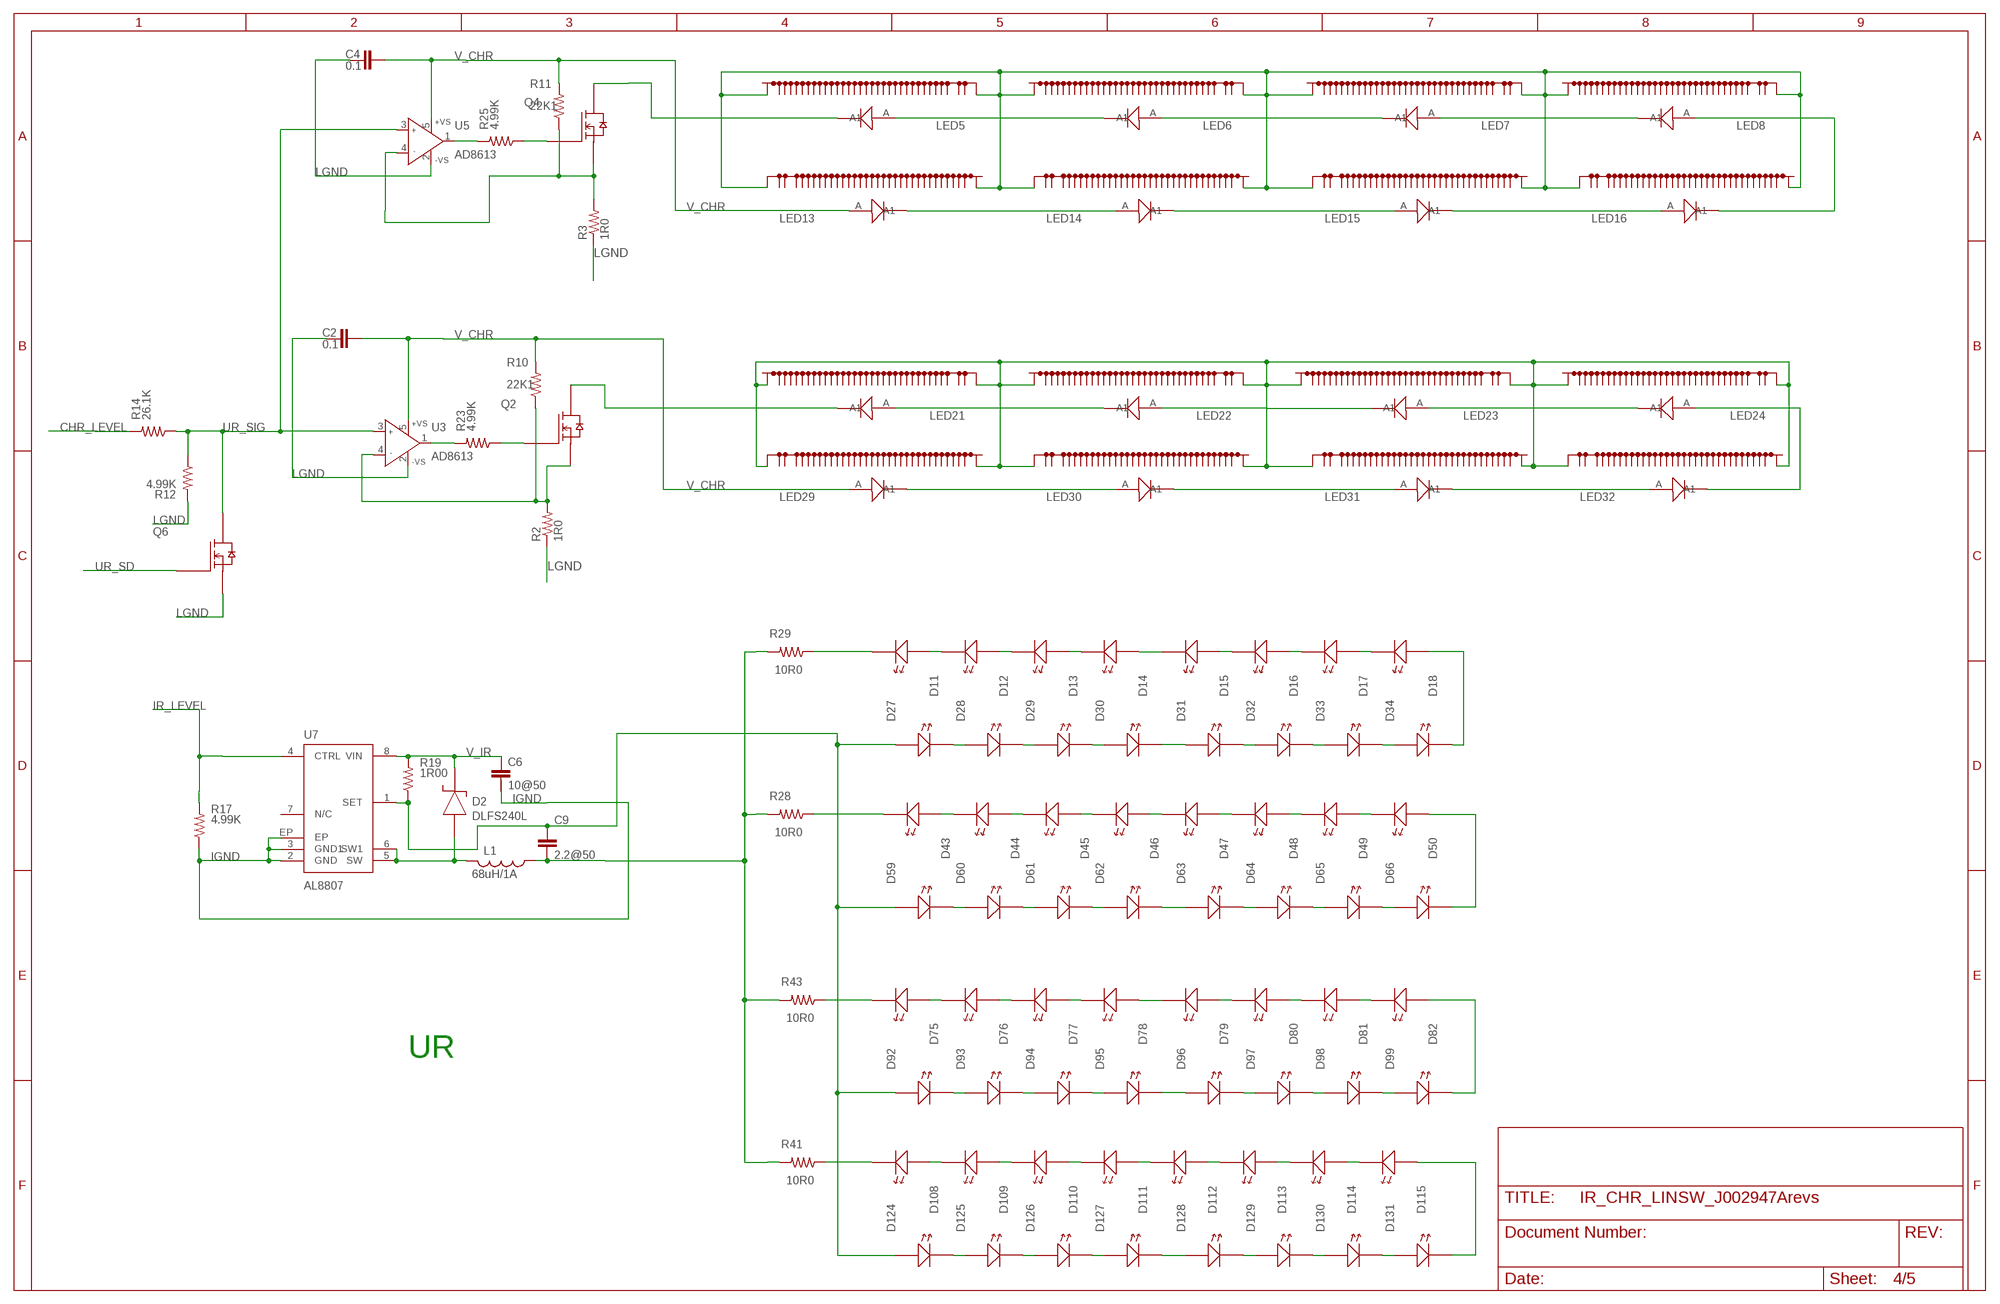
[diagram p3: schematic, sheet 4]

### Parts
C2  0.1  CAPS0603S  [0603S]
C4  0.1  CAPS0603S  [0603S]
C6  10@50  CAPS1206S  [1206S]
C9  2.2@50  CAPS1206S  [1206S]
D2  DLFS240L  DIODE_SCHOTTKYPWRDI-123  [PWRDI-123]
D11  LEDLED_SFH4050_HEAT  [LED_SFH4050_HEAT]
D12  LEDLED_SFH4050_HEAT  [LED_SFH4050_HEAT]
D13  LEDLED_SFH4050_HEAT  [LED_SFH4050_HEAT]
D14  LEDLED_SFH4050_HEAT  [LED_SFH4050_HEAT]
D15  LEDLED_SFH4050_HEAT  [LED_SFH4050_HEAT]
D16  LEDLED_SFH4050_HEAT  [LED_SFH4050_HEAT]
D17  LEDLED_SFH4050_HEAT  [LED_SFH4050_HEAT]
D18  LEDLED_SFH4050_HEAT  [LED_SFH4050_HEAT]
D27  LEDLED_SFH4050_HEAT  [LED_SFH4050_HEAT]
D28  LEDLED_SFH4050_HEAT  [LED_SFH4050_HEAT]
D29  LEDLED_SFH4050_HEAT  [LED_SFH4050_HEAT]
D30  LEDLED_SFH4050_HEAT  [LED_SFH4050_HEAT]
D31  LEDLED_SFH4050_HEAT  [LED_SFH4050_HEAT]
D32  LEDLED_SFH4050_HEAT  [LED_SFH4050_HEAT]
D33  LEDLED_SFH4050_HEAT  [LED_SFH4050_HEAT]
D34  LEDLED_SFH4050_HEAT  [LED_SFH4050_HEAT]
D43  LEDLED_SFH4050_HEAT  [LED_SFH4050_HEAT]
D44  LEDLED_SFH4050_HEAT  [LED_SFH4050_HEAT]
D45  LEDLED_SFH4050_HEAT  [LED_SFH4050_HEAT]
D46  LEDLED_SFH4050_HEAT  [LED_SFH4050_HEAT]
D47  LEDLED_SFH4050_HEAT  [LED_SFH4050_HEAT]
D48  LEDLED_SFH4050_HEAT  [LED_SFH4050_HEAT]
D49  LEDLED_SFH4050_HEAT  [LED_SFH4050_HEAT]
D50  LEDLED_SFH4050_HEAT  [LED_SFH4050_HEAT]
D59  LEDLED_SFH4050_HEAT  [LED_SFH4050_HEAT]
D60  LEDLED_SFH4050_HEAT  [LED_SFH4050_HEAT]
D61  LEDLED_SFH4050_HEAT  [LED_SFH4050_HEAT]
D62  LEDLED_SFH4050_HEAT  [LED_SFH4050_HEAT]
D63  LEDLED_SFH4050_HEAT  [LED_SFH4050_HEAT]
D64  LEDLED_SFH4050_HEAT  [LED_SFH4050_HEAT]
D65  LEDLED_SFH4050_HEAT  [LED_SFH4050_HEAT]
D66  LEDLED_SFH4050_HEAT  [LED_SFH4050_HEAT]
D75  LEDLED_SFH4050_HEAT  [LED_SFH4050_HEAT]
D76  LEDLED_SFH4050_HEAT  [LED_SFH4050_HEAT]
D77  LEDLED_SFH4050_HEAT  [LED_SFH4050_HEAT]
D78  LEDLED_SFH4050_HEAT  [LED_SFH4050_HEAT]
D79  LEDLED_SFH4050_HEAT  [LED_SFH4050_HEAT]
D80  LEDLED_SFH4050_HEAT  [LED_SFH4050_HEAT]
D81  LEDLED_SFH4050_HEAT  [LED_SFH4050_HEAT]
D82  LEDLED_SFH4050_HEAT  [LED_SFH4050_HEAT]
D92  LEDLED_SFH4050_HEAT  [LED_SFH4050_HEAT]
D93  LEDLED_SFH4050_HEAT  [LED_SFH4050_HEAT]
D94  LEDLED_SFH4050_HEAT  [LED_SFH4050_HEAT]
D95  LEDLED_SFH4050_HEAT  [LED_SFH4050_HEAT]
D96  LEDLED_SFH4050_HEAT  [LED_SFH4050_HEAT]
D97  LEDLED_SFH4050_HEAT  [LED_SFH4050_HEAT]
D98  LEDLED_SFH4050_HEAT  [LED_SFH4050_HEAT]
D99  LEDLED_SFH4050_HEAT  [LED_SFH4050_HEAT]
D108  LEDLED_SFH4050_HEAT  [LED_SFH4050_HEAT]
D109  LEDLED_SFH4050_HEAT  [LED_SFH4050_HEAT]
D110  LEDLED_SFH4050_HEAT  [LED_SFH4050_HEAT]
D111  LEDLED_SFH4050_HEAT  [LED_SFH4050_HEAT]
D112  LEDLED_SFH4050_HEAT  [LED_SFH4050_HEAT]
D113  LEDLED_SFH4050_HEAT  [LED_SFH4050_HEAT]
D114  LEDLED_SFH4050_HEAT  [LED_SFH4050_HEAT]
D115  LEDLED_SFH4050_HEAT  [LED_SFH4050_HEAT]
D124  LEDLED_SFH4050_HEAT  [LED_SFH4050_HEAT]
D125  LEDLED_SFH4050_HEAT  [LED_SFH4050_HEAT]
D126  LEDLED_SFH4050_HEAT  [LED_SFH4050_HEAT]
D127  LEDLED_SFH4050_HEAT  [LED_SFH4050_HEAT]
D128  LEDLED_SFH4050_HEAT  [LED_SFH4050_HEAT]
D129  LEDLED_SFH4050_HEAT  [LED_SFH4050_HEAT]
D130  LEDLED_SFH4050_HEAT  [LED_SFH4050_HEAT]
D131  LEDLED_SFH4050_HEAT  [LED_SFH4050_HEAT]
L1  68uH/1A  INDUCTOR_SMSRU8043  [SRU8043]
LED5  REBEL_0603OG_LED_W0603_EVEN_12  [OG_LED_W0603_EVEN_12]
LED6  REBEL_0603OG_LED_W0603_EVEN_12  [OG_LED_W0603_EVEN_12]
LED7  REBEL_0603OG_LED_W0603_EVEN_12  [OG_LED_W0603_EVEN_12]
LED8  REBEL_0603OG_LED_W0603_EVEN_12  [OG_LED_W0603_EVEN_12]
LED13  REBEL_0603OG_LED_W0603_EVEN_12  [OG_LED_W0603_EVEN_12]
LED14  REBEL_0603OG_LED_W0603_EVEN_12  [OG_LED_W0603_EVEN_12]
LED15  REBEL_0603OG_LED_W0603_EVEN_12  [OG_LED_W0603_EVEN_12]
LED16  REBEL_0603OG_LED_W0603_EVEN_12  [OG_LED_W0603_EVEN_12]
LED21  REBEL_0603OG_LED_W0603_EVEN_12  [OG_LED_W0603_EVEN_12]
LED22  REBEL_0603OG_LED_W0603_EVEN_12  [OG_LED_W0603_EVEN_12]
LED23  REBEL_0603OG_LED_W0603_EVEN_12  [OG_LED_W0603_EVEN_12]
LED24  REBEL_0603OG_LED_W0603_EVEN_12  [OG_LED_W0603_EVEN_12]
LED29  REBEL_0603OG_LED_W0603_EVEN_12  [OG_LED_W0603_EVEN_12]
LED30  REBEL_0603OG_LED_W0603_EVEN_12  [OG_LED_W0603_EVEN_12]
LED31  REBEL_0603OG_LED_W0603_EVEN_12  [OG_LED_W0603_EVEN_12]
LED32  REBEL_0603OG_LED_W0603_EVEN_12  [OG_LED_W0603_EVEN_12]
Q2  MOSFET-NTI252_HS  [TO252_HS]
Q4  MOSFET-NTI252_HS  [TO252_HS]
Q6  MOSFET-N  [SC-70]
R2  1R0  RESISTOR-POWER2512_HS1  [2512WIDE_HS1]
R3  1R0  RESISTOR-POWER2512_HS1  [2512WIDE_HS1]
R10  22K1  RESISTOR_SM0805S  [0805S]
R11  22K1  RESISTOR_SM0805S  [0805S]
R12  4.99K  RESISTOR_SM0603S  [0603S]
R14  26.1K  RESISTOR_SM0603S  [0603S]
R17  4.99K  RESISTOR_SM0805S  [0805S]
R19  1R00  RESISTOR_SM1206S  [1206S]
R23  4.99K  RESISTOR_SM0603S  [0603S]
R25  4.99K  RESISTOR_SM0603S  [0603S]
R28  10R0  RESISTOR_SM1206S  [1206S]
R29  10R0  RESISTOR_SM1206S  [1206S]
R41  10R0  RESISTOR_SM1206S  [1206S]
R43  10R0  RESISTOR_SM1206S  [1206S]
U3  AD8613  AD8065RT  [SOT23-5]
U5  AD8613  AD8065RT  [SOT23-5]
U7  AL8807  AD8807  [MSOP8-EP]

### Nets
CHR_LEVEL: R14.2 ; also sheet 1,2,3,5
IGND: C6.2 R17.1 U7.2(GND) U7.3(GND1) U7.EP ; also sheet 1,2,3,5
IR_DRV_UR: C9.1 D27.A D27.A1(A) D59.A D59.A1(A) D92.A D92.A1(A) D124.A D124.A1(A) R19.1 U7.1(SET)
IR_LEVEL: R17.2 U7.4(CTRL) ; also sheet 1,2,3,5
IR_RET_UR: C9.2 L1.1 R28.2 R29.2 R41.2 R43.2
LGND: C2.2 C4.2 Q6.2(S) R2.1 R2.1A R2.1A1 R2.1B R2.1B1 R2.1C R3.1 R3.1A R3.1A1 R3.1B R3.1B1 R3.1C R12.2 U3.2(-VS) U5.2(-VS) ; also sheet 1,2,3,5
N$73: Q4.2(S) R3.2 R11.1 U5.4(IN-)
N$85: D2.A L1.2 U7.5(SW) U7.6(SW1)
N$118: Q4.1(G) R25.1
N$124: R25.2 U5.1(OUT)
N$136: Q2.2(S) R2.2 R10.1 U3.4(IN-)
N$137: R23.2 U3.1(OUT)
N$139: Q2.1(G) R23.1
N$392: D81.A D81.A1(A) D82.C1(K) D82.C(K)
N$393: D80.A D80.A1(A) D81.C1(K) D81.C(K)
N$394: D79.A D79.A1(A) D80.C1(K) D80.C(K)
N$395: D77.A D77.A1(A) D78.C1(K) D78.C(K)
N$396: D76.A D76.A1(A) D77.C1(K) D77.C(K)
N$397: D75.A D75.A1(A) D76.C1(K) D76.C(K)
N$398: D92.C1(K) D92.C(K) D93.A D93.A1(A)
N$399: D114.A D114.A1(A) D115.C1(K) D115.C(K)
N$400: D113.A D113.A1(A) D114.C1(K) D114.C(K)
N$401: D112.A D112.A1(A) D113.C1(K) D113.C(K)
N$402: D111.A D111.A1(A) D112.C1(K) D112.C(K)
N$403: D110.A D110.A1(A) D111.C1(K) D111.C(K)
N$404: D109.A D109.A1(A) D110.C1(K) D110.C(K)
N$405: D108.A D108.A1(A) D109.C1(K) D109.C(K)
N$406: D96.C1(K) D96.C(K) D97.A D97.A1(A)
N$407: D97.C1(K) D97.C(K) D98.A D98.A1(A)
N$408: D98.C1(K) D98.C(K) D99.A D99.A1(A)
N$409: D124.C1(K) D124.C(K) D125.A D125.A1(A)
N$410: D126.C1(K) D126.C(K) D127.A D127.A1(A)
N$411: D128.C1(K) D128.C(K) D129.A D129.A1(A)
N$412: D129.C1(K) D129.C(K) D130.A D130.A1(A)
N$413: D130.C1(K) D130.C(K) D131.A D131.A1(A)
N$414: D82.A D82.A1(A) D99.C1(K) D99.C(K)
N$415: D127.C1(K) D127.C(K) D128.A D128.A1(A)
N$416: D115.A D115.A1(A) D131.C1(K) D131.C(K)
N$419: D49.A D49.A1(A) D50.C1(K) D50.C(K)
N$420: D46.A D46.A1(A) D47.C1(K) D47.C(K)
N$421: D45.A D45.A1(A) D46.C1(K) D46.C(K)
N$422: D44.A D44.A1(A) D45.C1(K) D45.C(K)
N$423: D43.A D43.A1(A) D44.C1(K) D44.C(K)
N$424: D31.C1(K) D31.C(K) D32.A D32.A1(A)
N$426: D59.C1(K) D59.C(K) D60.A D60.A1(A)
N$427: D17.A D17.A1(A) D18.C1(K) D18.C(K)
N$428: D16.A D16.A1(A) D17.C1(K) D17.C(K)
N$429: D15.A D15.A1(A) D16.C1(K) D16.C(K)
N$430: D13.A D13.A1(A) D14.C1(K) D14.C(K)
N$431: D12.A D12.A1(A) D13.C1(K) D13.C(K)
N$432: D30.C1(K) D30.C(K) D31.A D31.A1(A)
N$433: D18.A D18.A1(A) D34.C1(K) D34.C(K)
N$434: D28.C1(K) D28.C(K) D29.A D29.A1(A)
N$435: D50.A D50.A1(A) D66.C1(K) D66.C(K)
N$437: D47.A D47.A1(A) D48.C1(K) D48.C(K)
N$438: D125.C1(K) D125.C(K) D126.A D126.A1(A)
N$439: D95.C1(K) D95.C(K) D96.A D96.A1(A)
N$440: D33.C1(K) D33.C(K) D34.A D34.A1(A)
N$448: D78.A D78.A1(A) D79.C1(K) D79.C(K)
N$449: LED31.C(K1) LED32.A(A1)
N$450: LED24.A(A1) LED32.C(K1)
N$453: LED21.A(A1) LED22.C(K1)
N$454: LED22.A(A1) LED23.C(K1)
N$455: LED23.A(A1) LED24.C(K1)
N$456: LED15.C(K1) LED16.A(A1)
N$457: LED8.A(A1) LED16.C(K1)
N$458: LED14.C(K1) LED15.A(A1)
N$459: LED13.C(K1) LED14.A(A1)
N$461: LED6.A(A1) LED7.C(K1)
N$464: D11.C1(K) D11.C(K) R29.1
N$472: D43.C1(K) D43.C(K) R28.1
N$477: D75.C1(K) D75.C(K) R43.1
N$480: D108.C1(K) D108.C(K) R41.1
N$481: D93.C1(K) D93.C(K) D94.A D94.A1(A)
N$482: D94.C1(K) D94.C(K) D95.A D95.A1(A)
N$483: D48.A D48.A1(A) D49.C1(K) D49.C(K)
N$484: D32.C1(K) D32.C(K) D33.A D33.A1(A)
N$485: D14.A D14.A1(A) D15.C1(K) D15.C(K)
N$486: D11.A D11.A1(A) D12.C1(K) D12.C(K)
N$487: D27.C1(K) D27.C(K) D28.A D28.A1(A)
N$488: D29.C1(K) D29.C(K) D30.A D30.A1(A)
N$489: D60.C1(K) D60.C(K) D61.A D61.A1(A)
N$490: D61.C1(K) D61.C(K) D62.A D62.A1(A)
N$491: D62.C1(K) D62.C(K) D63.A D63.A1(A)
N$492: D63.C1(K) D63.C(K) D64.A D64.A1(A)
N$493: D64.C1(K) D64.C(K) D65.A D65.A1(A)
N$494: D65.C1(K) D65.C(K) D66.A D66.A1(A)
N$495: LED30.C(K1) LED31.A(A1)
N$496: LED29.C(K1) LED30.A(A1)
N$497: LED5.A(A1) LED6.C(K1)
N$498: LED7.A(A1) LED8.C(K1)
Q5: LED21.C(K1) Q2.3(D) Q2.3S(D) Q2.P$1(D) Q2.P$2(D) Q2.P$3(D) Q2.P$4(D) Q2.P$5(D) Q2.P$6(D) Q2.P$7(D) Q2.P$8(D) Q2.P$9(D) Q2.P$10(D) Q2.P$11(D) Q2.P$12(D)
Q7: LED5.C(K1) Q4.3(D) Q4.3S(D) Q4.P$1(D) Q4.P$2(D) Q4.P$3(D) Q4.P$4(D) Q4.P$5(D) Q4.P$6(D) Q4.P$7(D) Q4.P$8(D) Q4.P$9(D) Q4.P$10(D) Q4.P$11(D) Q4.P$12(D)
TH: LED5.TH1(TH) LED5.TH@68(TH) LED6.TH1(TH) LED6.TH@68(TH) LED7.TH1(TH) LED7.TH@68(TH) LED8.TH1(TH) LED8.TH@68(TH) LED13.TH1(TH) LED13.TH@68(TH) LED14.TH1(TH) LED14.TH@68(TH) LED15.TH1(TH) LED15.TH@68(TH) LED16.TH1(TH) LED16.TH@68(TH) LED21.TH1(TH) LED21.TH@68(TH) LED22.TH1(TH) LED22.TH@68(TH) LED23.TH1(TH) LED23.TH@68(TH) LED24.TH1(TH) LED24.TH@68(TH) LED29.TH1(TH) LED29.TH@68(TH) LED30.TH1(TH) LED30.TH@68(TH) LED31.TH1(TH) LED31.TH@68(TH) LED32.TH1(TH) LED32.TH@68(TH) ; also sheet 2,3,5
UR_SD: Q6.1(G) ; also sheet 1
UR_SIG: Q6.3(D) R12.1 R14.1 U3.3(IN+) U5.3(IN+)
V_CHR: C2.1 C4.1 LED13.A(A1) LED29.A(A1) R10.2 R11.2 U3.5(+VS) U5.5(+VS) ; also sheet 1,2,3,5
V_IR: C6.1 D2.K R19.2 U7.8(VIN) ; also sheet 1,2,3,5
Unconnected: U7.7(N/C)

### Notes on the sheet
- UR